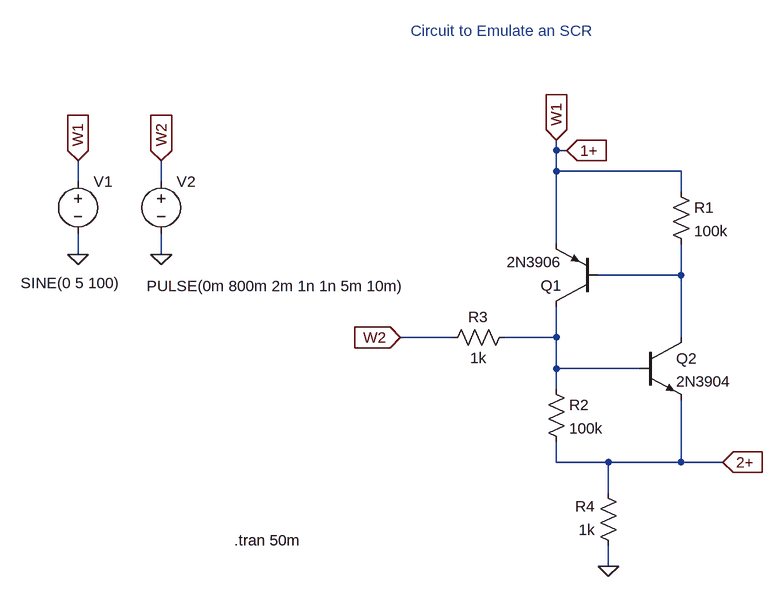
[diagram p0: schematic emulate_scr_ltspice.asc]
emulate_scr_ltspice.asc, the LTspice schematic file:
Version 4
SHEET 1 880 680
WIRE 160 -48 160 -64
WIRE 176 -48 160 -48
WIRE 160 -16 160 -48
WIRE 352 -16 160 -16
WIRE -576 0 -576 -32
WIRE -448 0 -448 -32
WIRE 352 16 352 -16
WIRE 160 96 160 -16
WIRE -576 112 -576 80
WIRE -448 112 -448 80
WIRE 352 144 352 96
WIRE 352 144 224 144
WIRE 0 240 -80 240
WIRE 160 240 160 192
WIRE 160 240 80 240
WIRE 352 240 352 144
WIRE 160 288 160 240
WIRE 288 288 160 288
WIRE 160 320 160 288
WIRE 160 432 160 400
WIRE 240 432 160 432
WIRE 352 432 352 336
WIRE 352 432 240 432
WIRE 416 432 352 432
WIRE 240 480 240 432
WIRE 240 592 240 560
FLAG 240 592 0
FLAG 160 -64 W1
IOPIN 160 -64 In
FLAG 176 -48 1+
IOPIN 176 -48 In
FLAG -80 240 W2
IOPIN -80 240 In
FLAG 416 432 2+
IOPIN 416 432 In
FLAG -576 112 0
FLAG -448 112 0
FLAG -576 -32 W1
IOPIN -576 -32 In
FLAG -448 -32 W2
IOPIN -448 -32 In
SYMBOL pnp 224 192 R180
SYMATTR InstName Q1
SYMATTR Value 2N3906
SYMBOL npn 288 240 R0
SYMATTR InstName Q2
SYMATTR Value 2N3904
SYMBOL res 336 0 R0
SYMATTR InstName R1
SYMATTR Value 100k
SYMBOL res 144 304 R0
SYMATTR InstName R2
SYMATTR Value 100k
SYMBOL res 96 224 R90
WINDOW 0 0 56 VBottom 2
WINDOW 3 32 56 VTop 2
SYMATTR InstName R3
SYMATTR Value 1k
SYMBOL res 256 576 R180
WINDOW 0 36 76 Left 2
WINDOW 3 36 40 Left 2
SYMATTR InstName R4
SYMATTR Value 1k
SYMBOL voltage -576 -16 R0
WINDOW 3 -88 172 Left 2
WINDOW 123 0 0 Left 0
WINDOW 39 0 0 Left 0
SYMATTR InstName V1
SYMATTR Value SINE(0 5 100)
SYMBOL voltage -448 -16 R0
WINDOW 3 -22 177 Left 2
WINDOW 123 0 0 Left 0
WINDOW 39 0 0 Left 0
SYMATTR InstName V2
SYMATTR Value PULSE(0m 800m 2m 1n 1n 5m 10m)
TEXT -336 552 Left 2 !.tran 50m
TEXT -64 -232 Left 2 ;Circuit to Emulate an SCR

The netlist it stands for:
* emulate_scr_ltspice.asc
Q1 N002 N001 1+ 0 2N3906
Q2 N001 N002 2+ 0 2N3904
R1 1+ N001 100k
R2 N002 2+ 100k
R3 N002 W2 1k
R4 0 2+ 1k
V1 1+ 0 SINE(0 5 100)
V2 W2 0 PULSE(0m 800m 2m 1n 1n 5m 10m)
.model NPN NPN
.model PNP PNP
.lib standard.bjt
.tran 50m
* Circuit to Emulate an SCR
.backanno
.end